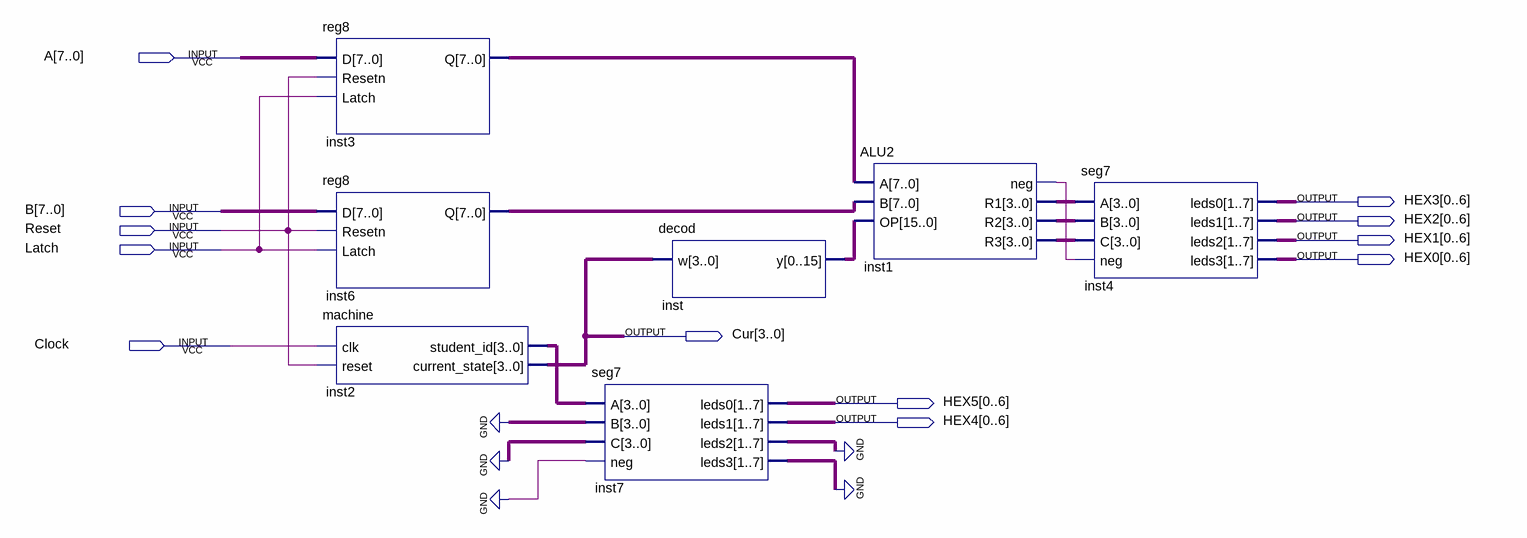
[diagram p0: schematic sheet]
// Quartus schematic Lab6Part2.bdf as structural Verilog: 7 symbols, 12 pins
module Lab6Part2 (
  input  [7:0] A,
  input  [7:0] B,
  input  Reset,
  input  Latch,
  input  Clock,
  output [0:6] HEX3,
  output [0:6] HEX2,
  output [0:6] HEX1,
  output [0:6] HEX0,
  output [3:0] Cur,
  output [0:6] HEX5,
  output [0:6] HEX4
);

  wire inst1_neg;
  wire [3:0] inst1_r1, inst1_r2, inst1_r3, inst2_student_id;
  wire [6:0] inst7_leds2, inst7_leds3;
  wire [7:0] inst3_q, inst6_q;
  wire [15:0] inst_y;

  reg8 inst3 (.D(A), .Resetn(Reset), .Latch(Latch), .Q(inst3_q));
  reg8 inst6 (.D(B), .Resetn(Reset), .Latch(Latch), .Q(inst6_q));
  machine inst2 (.clk(Clock), .reset(Reset), .student_id(inst2_student_id), .current_state(Cur));
  seg7 inst7 (
    .A(inst2_student_id), .B(4'b0000), .C(4'b0000), .neg(1'b0), .leds0(HEX5), .leds1(HEX4),
    .leds2(inst7_leds2), .leds3(inst7_leds3));
  decod inst (.w(Cur), .y(inst_y));
  ALU2 inst1 (.A(inst3_q), .B(inst6_q), .OP(inst_y), .neg(inst1_neg), .R1(inst1_r1), .R2(inst1_r2), .R3(inst1_r3));
  seg7 inst4 (
    .A(inst1_r1), .B(inst1_r2), .C(inst1_r3), .neg(inst1_neg), .leds0(HEX3), .leds1(HEX2), .leds2(HEX1),
    .leds3(HEX0));
  // also tied to GND on the sheet: {inst7_leds2[0], inst7_leds2[1], inst7_leds2[2], inst7_leds2[3], inst7_leds2[4], inst7_leds2[5], inst7_leds2[6], inst7_leds3[0], inst7_leds3[1], inst7_leds3[2], inst7_leds3[3], inst7_leds3[4], inst7_leds3[5], inst7_leds3[6]}
endmodule
